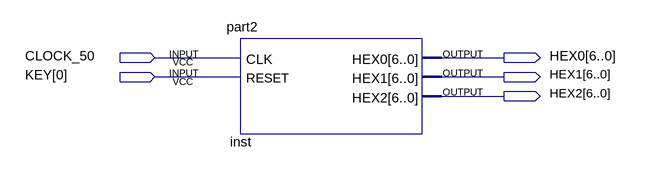
[diagram p0: schematic sheet]
// Quartus schematic part2_sch.bdf as structural Verilog: 1 symbols, 5 pins
module part2_sch (
  input  CLOCK_50,
  input  [0:0] KEY,
  output [6:0] HEX0,
  output [6:0] HEX1,
  output [6:0] HEX2
);

  part2 inst (.CLK(CLOCK_50), .RESET(KEY[0]), .HEX0(HEX0), .HEX1(HEX1), .HEX2(HEX2));
endmodule
